# EAGLE schematic FM-Radio (EAGLE 7.2.0)
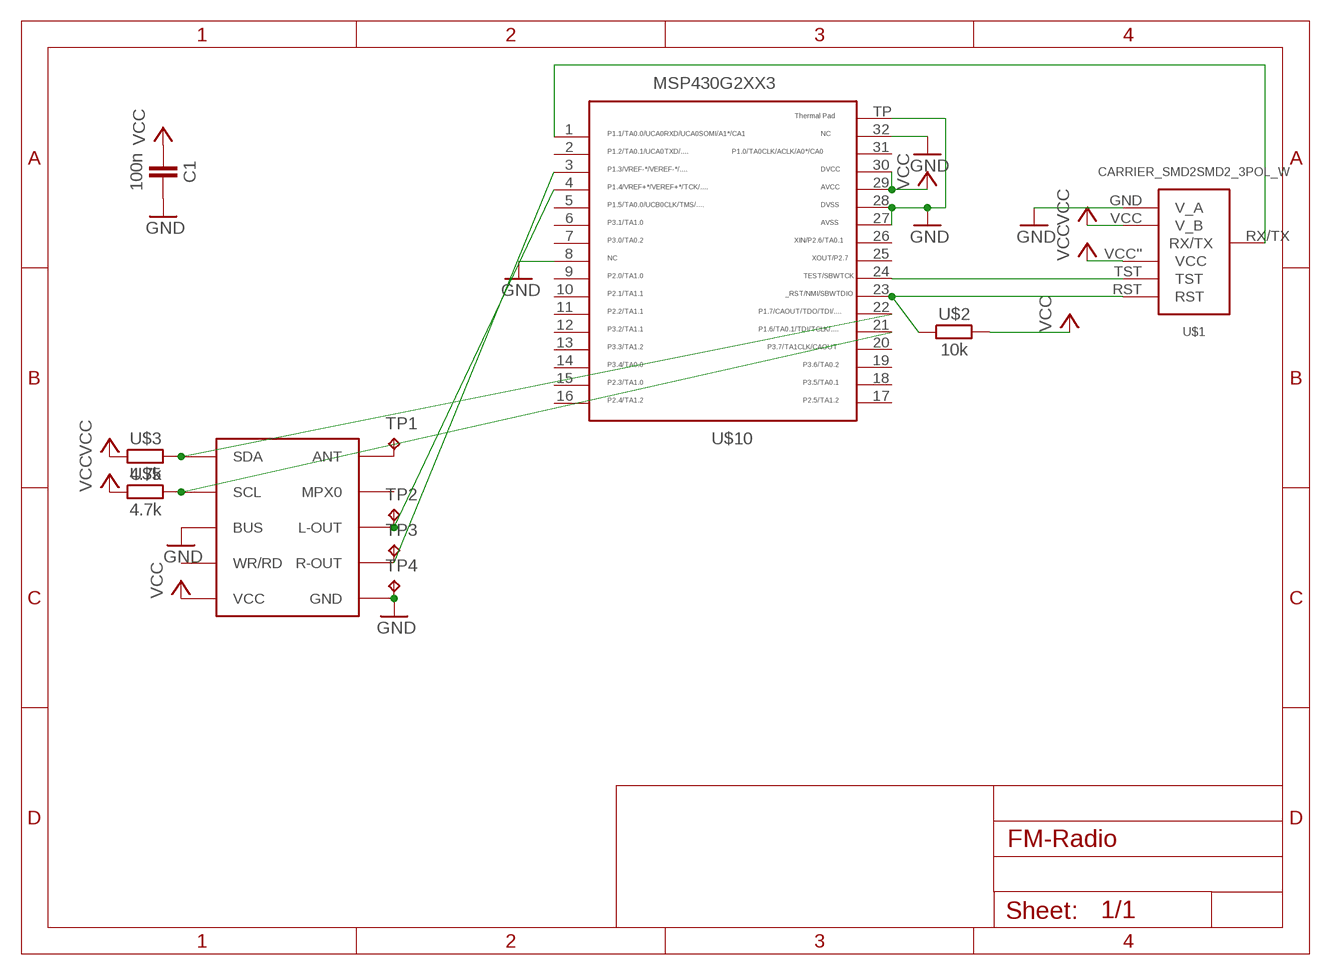
[diagram p0: schematic, sheet 1]

## Parts
C1  100n  CAPACITOR  [603]
TP1  TPTP06R  [TP06R]
TP2  TPTP06R  [TP06R]
TP3  TPTP06R  [TP06R]
TP4  TPTP06R  [TP06R]
U$1  CARRIER_SMD2SMD2_3POL_W  [CARRIER_SMD2_WIDE_3POL]
U$2  10k  RESISTOR0603  [603]
U$3  4.7k  RESISTOR0603  [603]
U$4  FM-RADIO  [FM-RADIO]
U$5  4.7k  RESISTOR0603  [603]
U$10  MSP430G2553  [QFN32]

## Nets
GND: C1.2 TP4.TP U$1.GND(V_A) U$4.PAD3(BUS) U$4.PAD6(GND) U$10.8 U$10.27 U$10.28 U$10.32 U$10.TP
N$2: TP2.TP U$4.PAD9(L-OUT) U$10.4
N$3: U$1.TST U$10.24
N$4: U$1.RST U$2.1 U$10.23
N$5: TP3.TP U$4.PAD7(R-OUT) U$10.3
N$6: TP1.TP U$4.PAD11(ANT)
N$7: U$3.2 U$4.PAD1(SDA) U$10.22
N$11: U$4.PAD2(SCL) U$5.2 U$10.21
N$12: U$1.RX/TX U$10.1
VCC: C1.1 U$1.VCC''(VCC) U$1.VCC(V_B) U$2.2 U$3.1 U$4.PAD5(VCC) U$5.1 U$10.29 U$10.30
Unconnected: U$4.PAD4(WR/RD) U$4.PAD10(MPX0) U$10.2 U$10.5 U$10.6 U$10.7 U$10.9 U$10.10 U$10.11 U$10.12 U$10.13 U$10.14 U$10.15 U$10.16 U$10.17 U$10.18 U$10.19 U$10.20 U$10.25 U$10.26 U$10.31

## Library data of the parts
C1 = thar:CAPACITOR
TP1-TP4 = testpad:TP: Test pad
U$1 = thar:CARRIER_SMD2
U$2 U$3 U$5 = thar:RESISTOR
U$4 = thar:FM-RADIO: TEA5767 Programmable Module FM Stereo Radio Low-power Stereo Modul CP06007 Bezug: Ebay-Eckstein <http://stores.ebay.de/ecksteinkomponente/>
U$10 = thar:MSP430G2553: TEXAS INSTRUMENTS MSP430G2553IRHB32R MCU, 16BIT, MSP430, 16MHZ, QFN-32 Farnell Best.Nr.: 2325726 Herst.Bez.: MSP430G2553IRHB32R